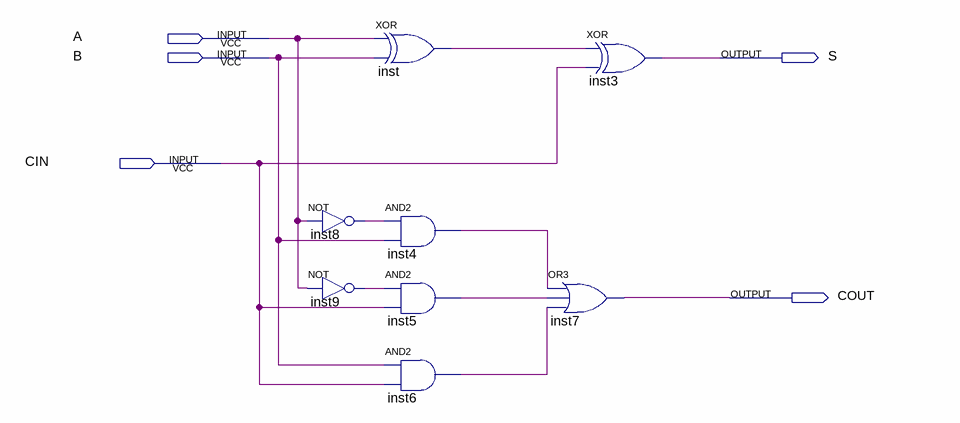
[diagram p0: schematic sheet]
// Quartus schematic SubtratorCompleto.bdf as structural Verilog: 8 symbols, 5 pins
module SubtratorCompleto (
  input  A,
  input  B,
  input  CIN,
  output S,
  output COUT
);

  wire inst4_out, inst5_out, inst6_out, inst8_out, inst9_out, inst_out;

  not inst8 (inst8_out, A);
  not inst9 (inst9_out, A);
  xor inst (inst_out, A, B);
  and inst4 (inst4_out, inst8_out, B);
  and inst5 (inst5_out, inst9_out, CIN);
  and inst6 (inst6_out, B, CIN);
  or inst7 (COUT, inst4_out, inst5_out, inst6_out);
  xor inst3 (S, inst_out, CIN);
endmodule
